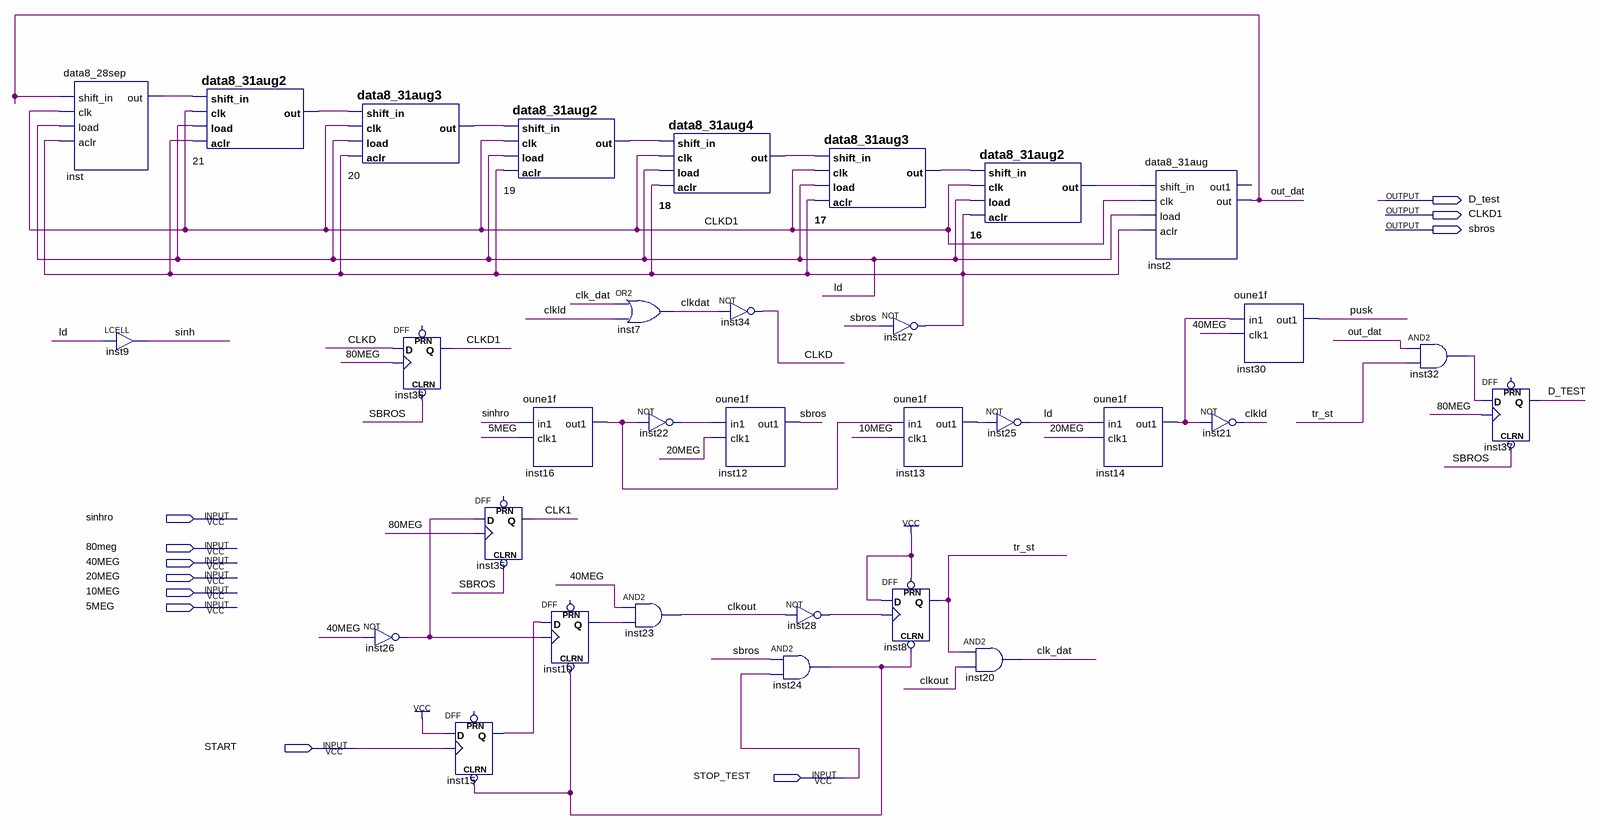
[diagram p0: schematic sheet]
// Quartus schematic data32_29sept_internal.bdf as structural Verilog: 32 symbols, 11 pins
module data32_29sept_internal (
  input  sinhro,
  input  \80meg ,
  input  \40MEG ,
  input  \20MEG ,
  input  \10MEG ,
  input  \5MEG ,
  input  START,
  input  STOP_TEST,
  output D_test,
  output CLKD1,
  output sbros
);

  wire CLK1, clk_dat, CLKD, clkdat, clkld, clkout, inst10_q, inst13_out1, inst14_out1, inst15_q, inst16_out1,
       inst22_out, inst24_out, inst26_out, inst27_out, inst28_out, inst32_out, inst_out, ld, n16_out,
       n17_out, n18_out, n19_out, n20_out, n21_out, out_dat, pusk, sinh, tr_st;

  data8_28sep inst (.shift_in(out_dat), .clk(CLKD1), .load(ld), .aclr(inst27_out), .out(inst_out));
  LCELL inst9 (.IN(ld), .OUT(sinh));
  data8_31aug2 u_21 (.shift_in(inst_out), .clk(CLKD1), .load(ld), .aclr(inst27_out), .out(n21_out));
  data8_31aug3 u_20 (.shift_in(n21_out), .clk(CLKD1), .load(ld), .aclr(inst27_out), .out(n20_out));
  DFF inst36 (.CLRN(sbros), .CLK(\80meg ), .D(CLKD), .Q(CLKD1));  // open: PRN
  not inst26 (inst26_out, \40MEG );
  DFF inst15 (.CLRN(inst24_out), .CLK(START), .D(1'b1), .Q(inst15_q));  // open: PRN
  data8_31aug2 u_19 (.shift_in(n20_out), .clk(CLKD1), .load(ld), .aclr(inst27_out), .out(n19_out));
  DFF inst35 (.CLRN(sbros), .CLK(\80meg ), .D(inst26_out), .Q(CLK1));  // open: PRN
  oune1f inst16 (.in1(sinhro), .clk1(\5MEG ), .out1(inst16_out1));
  DFF inst10 (.CLRN(inst24_out), .CLK(inst26_out), .D(inst15_q), .Q(inst10_q));  // open: PRN
  or inst7 (clkdat, clk_dat, clkld);
  and inst23 (clkout, \40MEG , inst10_q);
  data8_31aug4 u_18 (.shift_in(n19_out), .clk(CLKD1), .load(ld), .aclr(inst27_out), .out(n18_out));
  not inst22 (inst22_out, inst16_out1);
  not inst34 (CLKD, clkdat);
  oune1f inst12 (.in1(inst22_out), .clk1(\20MEG ), .out1(sbros));
  not inst28 (inst28_out, clkout);
  and inst24 (inst24_out, sbros, STOP_TEST);
  data8_31aug3 u_17 (.shift_in(n18_out), .clk(CLKD1), .load(ld), .aclr(inst27_out), .out(n17_out));
  not inst27 (inst27_out, sbros);
  oune1f inst13 (.in1(inst16_out1), .clk1(\10MEG ), .out1(inst13_out1));
  DFF inst8 (.CLRN(inst24_out), .CLK(inst28_out), .D(1'b1), .PRN(1'b1), .Q(tr_st));
  data8_31aug2 u_16 (.shift_in(n17_out), .clk(CLKD1), .load(ld), .aclr(inst27_out), .out(n16_out));
  not inst25 (ld, inst13_out1);
  and inst20 (clk_dat, tr_st, clkout);
  oune1f inst14 (.in1(ld), .clk1(\20MEG ), .out1(inst14_out1));
  data8_31aug inst2 (.shift_in(n16_out), .clk(CLKD1), .load(ld), .aclr(inst27_out), .out(out_dat));  // open: out1
  not inst21 (clkld, inst14_out1);
  oune1f inst30 (.in1(inst14_out1), .clk1(\40MEG ), .out1(pusk));
  and inst32 (inst32_out, out_dat, tr_st);
  DFF inst37 (.CLRN(sbros), .CLK(\80meg ), .D(inst32_out), .Q(D_test));  // open: PRN
endmodule
